# EAGLE design DNS (EAGLE 6.5.0)
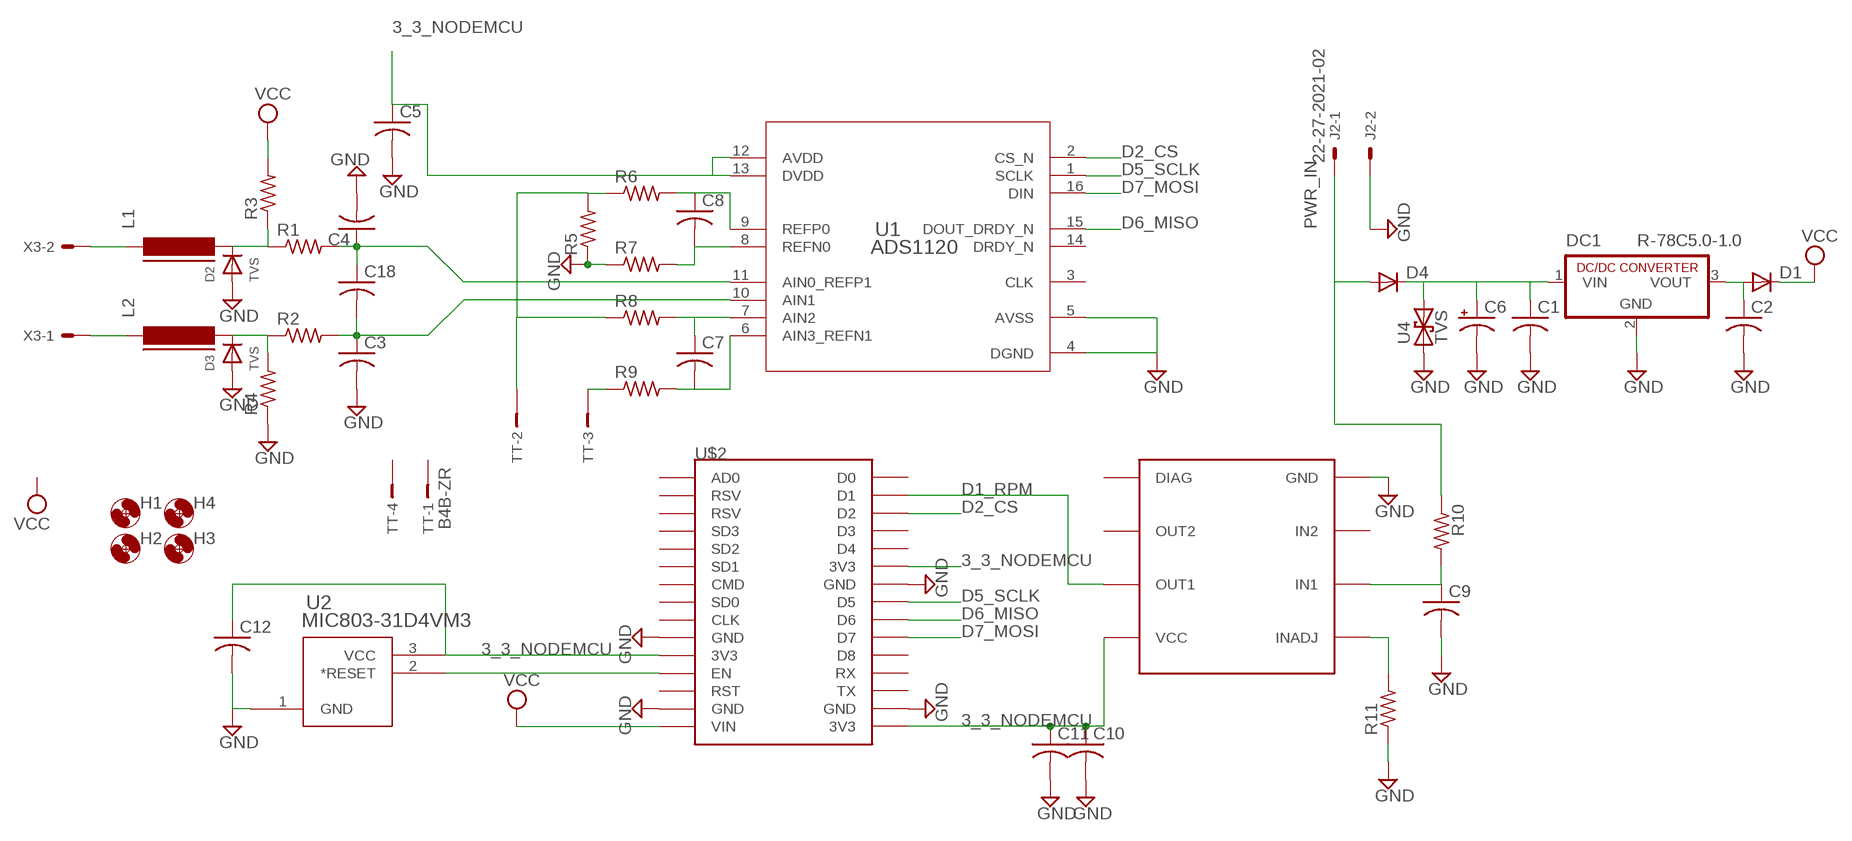
[diagram p0: schematic, sheet 1]

## Parts
C1  C-USC0805  [C0805]
C2  C-USC0805  [C0805]
C3  C-USC0805  [C0805]
C4  C-USC0805  [C0805]
C5  C-USC0805  [C0805]
C6  CPOL-USE5-10.5  [E5-10,5]
C7  C-USC0805  [C0805]
C8  C-USC0805  [C0805]
C9  C-USC0805  [C0805]
C10  C-USC0805  [C0805]
C11  C-USC0805  [C0805]
C12  C-USC0805  [C0805]
C18  C-USC0805  [C0805]
D1  DIODE-DO-214AC  [DO-214AC]
D2  TVS  DIODESOD-323F  [SOD-323F]
D3  TVS  DIODESOD-323F  [SOD-323F]
D4  DIODE-DO-214AC  [DO-214AC]
DC1  R-78C5.0-1.0  [SIP3]
H1  MOUNT-HOLE2.8  [2,8]
H2  MOUNT-HOLE2.8  [2,8]
H3  MOUNT-HOLE2.8  [2,8]
H4  MOUNT-HOLE2.8  [2,8]
J2  22-27-2021-02  [6410-02]
L1  FERRITE-0805  [FB805]
L2  FERRITE-0805  [FB805]
R1  R-US_R0805W  [R0805W]
R2  R-US_R0805W  [R0805W]
R3  R-US_R0805W  [R0805W]
R4  R-US_R0805W  [R0805W]
R5  R-US_R0805W  [R0805W]
R6  R-US_R0805W  [R0805W]
R7  R-US_R0805W  [R0805W]
R8  R-US_R0805W  [R0805W]
R9  R-US_R0805W  [R0805W]
R10  R-US_R0805W  [R0805W]
R11  R-US_R0805W  [R0805W]
TT  B4B-ZR  [B4B-ZR]
U1  ADS1120  ADS1120IPWR  [PW0016A_N]
U2  MIC803-31D4VM3  [SOT-23_M3]
U4  TVS  [SMA-DIODE]
U$1  NCV1124  [TESTER]
U$2  ESP12E_DEVKIT  [ESP12E_DEVKIT]
X3  22-23-2021  [22-23-2021]

## Nets
3_3_NODEMCU: C10.1 C11.1 C12.1 U2.3(VCC) U$1.VCC U$2.3V3@0(3V3) U$2.3V3@1(3V3) U$2.3V3@2(3V3)
D1_RPM: U$1.OUT1 U$2.D1
D2_CS: U1.2(CS_N) U$2.D2
D5_SCLK: U1.1(SCLK) U$2.D5
D6_MISO: U1.15(DOUT_DRDY_N) U$2.D6
D7_MOSI: U1.16(DIN) U$2.D7
GND: C1.2 C2.2 C3.2 C4.2 C5.2 C6.- C9.2 C10.2 C11.2 C12.2 D2.A D3.A DC1.2(GND) J2.2 R4.1 R5.1 R7.1 R11.1 U1.4(DGND) U1.5(AVSS) U2.1(GND) U4.A U$1.GND U$2.GND@0(GND) U$2.GND@1(GND) U$2.GND@2(GND) U$2.GND@3(GND)
N$1: C1.1 C6.+ D4.C DC1.1(VIN) U4.C
N$2: C2.1 D1.A DC1.3(VOUT)
N$3: C7.2 R9.2 U1.6(AIN3_REFN1)
N$4: C8.2 R7.2 U1.8(REFN0)
N$5: D3.C L2.2 R2.1 R4.2
N$6: C4.1 C18.1 R1.2 U1.11(AIN0_REFP1)
N$7: C3.1 C18.2 R2.2 U1.10(AIN1)
N$8: D2.C L1.2 R1.1 R3.1
N$9: R11.2 U$1.INADJ
N$10: C8.1 R6.2 U1.9(REFP0)
N$11: U2.2(*RESET) U$2.EN
N$12: C7.1 R8.2 U1.7(AIN2)
N$13: C9.1 R10.2 U$1.IN1
N$14: L2.1 X3.1
N$15: R9.1 TT.3
N$17: L1.1 X3.2
N$18: C5.1 U1.12(AVDD) U1.13(DVDD)
PWR_IN: D4.A J2.1 R10.1
REF_P: R5.2 R6.1 R8.1 TT.2
VCC: D1.C R3.2 U$2.VIN
Unconnected: TT.1 TT.4 U1.3(CLK) U1.14(DRDY_N) U$1.DIAG U$1.IN2 U$1.OUT2 U$2.AD0 U$2.CLK U$2.CMD U$2.D0 U$2.D3 U$2.D4 U$2.D8 U$2.RST U$2.RSV@0(RSV) U$2.RSV@1(RSV) U$2.RX U$2.SD0 U$2.SD1 U$2.SD2 U$2.SD3 U$2.TX

## Library data of the parts
C1-C5 C7-C12 C18 = adafruit:C-US: CAPACITOR, American symbol
C6 = resistor:CPOL-US: POLARIZED CAPACITOR, American symbol
D1 D4 = diode:DIODE-: DIODE
D2 D3 = adafruit:DIODE: Diode SMADIODE - SMA Surface Mount Package 20V 1A Schottky Diode Digikey: 641-1014-6-ND DO-1N4148 - Through Hole Small Current Diode SOD-123 20V 1 A (.5mV Vf) Schottky Diode - Digikey: MBRX120TPMSCT-ND SOD-323 10V 570mA (.38mV Vf, 3ns) Schottky Diode - Digikey: ZLLS410CT-ND SOD-523 30V 30mA Schottky Diode (RB751S-40TE61) - Digikey: RB751S-40TE61CT-ND SOT23-R/W - SOT23 Package (R = Solder Paste/Reflow Ovens, W = Hand-Soldering) BAT54Film 40V 300mA - Digikey: 497-7162-1-ND
DC1 = dc-dc-converter:R-78C*-1.0: INNOLINE DC/DC-Converter 1.0 AMP SIP3 Single Output Source: Data sheet <http://www.mikrocontroller.net/attachment/150645/157764-da-01-en-DC_DC_WANDLER_R_78C5_0_1_0.pdf>
H1-H4 = holes:MOUNT-HOLE: MOUNTING HOLE with drill center marker
J2 = con-molex:22-?-02: CONNECTOR wire to board 2.54 mm (.1 inch) pitch header; OC_FARNELL: unknown; OC_NEWARK: unknown
L1 L2 = dp_devices:FERRITE: Ferrite bead in various packages
R1-R11 = adafruit:R-US_: RESISTOR, American symbol
TT = con-jst:?4B-ZR: ZH CONNECTOR 1.5 mm, 4 pin 1 row Source: http://www.jst.com .. eZH.pdf; MF: FARNELL; MPN: B4B-ZR(LF)(SN); OC_FARNELL: 1830916; OC_NEWARK: 37K9960
U1 = ADS1120:ADS1120IPWR; ALTERNATEPARTNUMBER: ADS1120IPW; COMPTYPE: IC; MANUFACTURER: Texas Instruments; MOUNTTYPE: SMT; PACKAGEREFERENCE: PW0016A; PARTNUMBER: ADS1120IPWR; PIN_COUNT: 16; REFDES: RefDes; ROHS: Y; TYPE: TYPE; VALUE: Value
U2 = MIC803:MIC803-31D4VM3; COPYRIGHT: Copyright (C) 2015 Accelerated Designs. All rights reserved; MANUFACTURER_PART_NUMBER: mic803-31d4vm3; VENDOR: MICREL
U4 = SparkFun-DiscreteSemi:TVS: Transient voltage suppressor- prevents ESD on inputs. Ignore package description- MBRA140 is NOT this type of part!!!
U$1 = NCV1124:NCV1124
U$2 = ESP12E_DEVKIT:ESP12E_DEVKIT: ESP12E DEVKIT BOARD
X3 = con-molex:22-23-2021: .100" (2.54mm) Center Header - 2 Pin; MF: MOLEX; MPN: 22-23-2021; OC_FARNELL: 1462926; OC_NEWARK: 25C3832

## Board
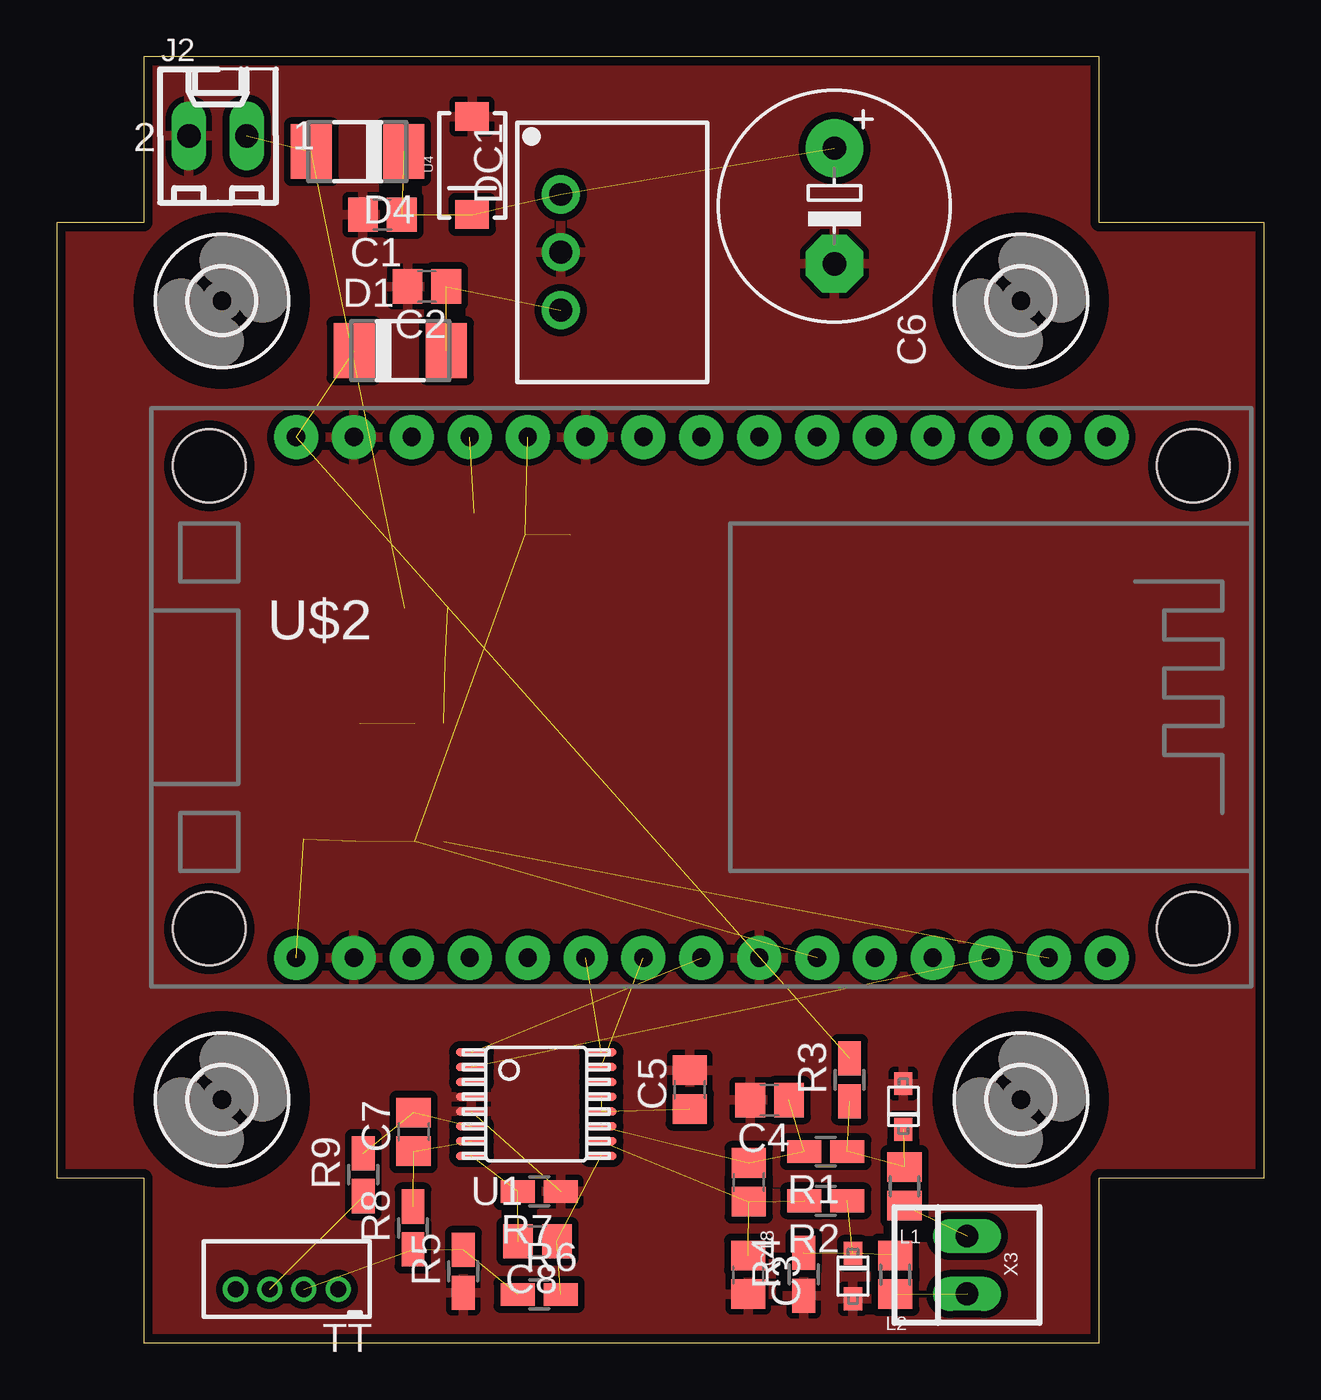
[diagram p1: board, top side]
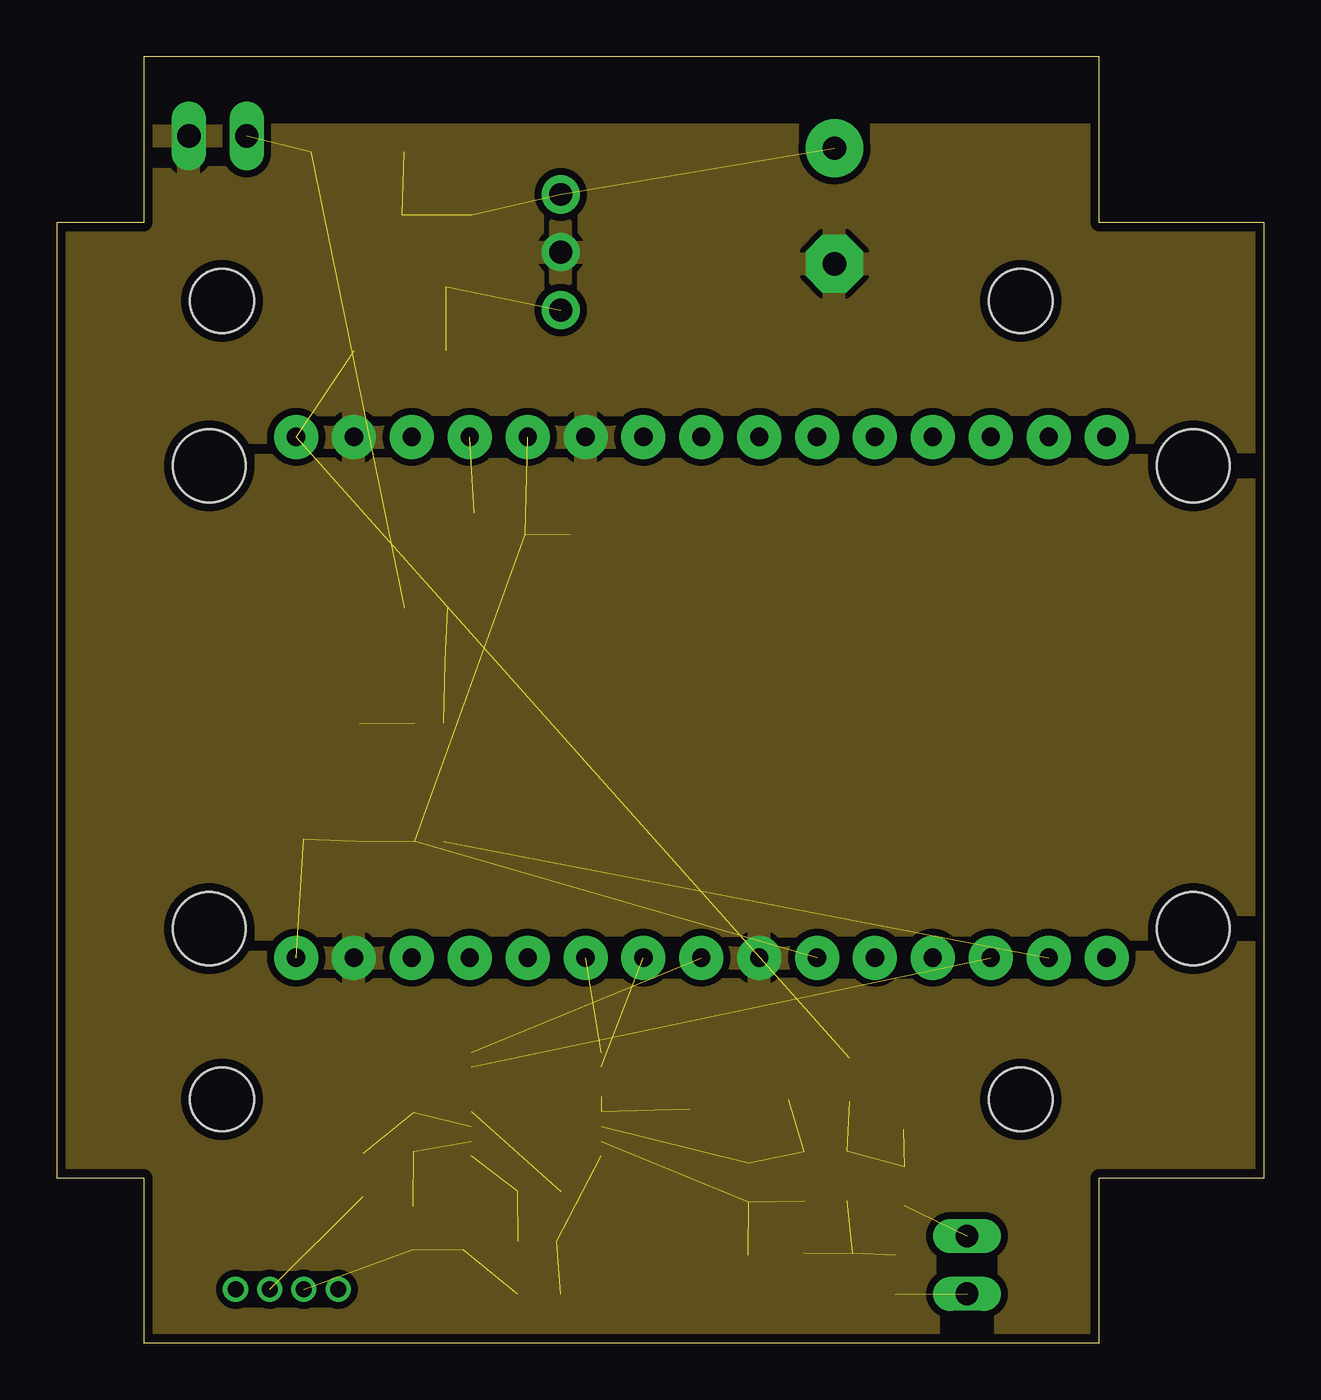
[diagram p2: board, inner layer Route2]
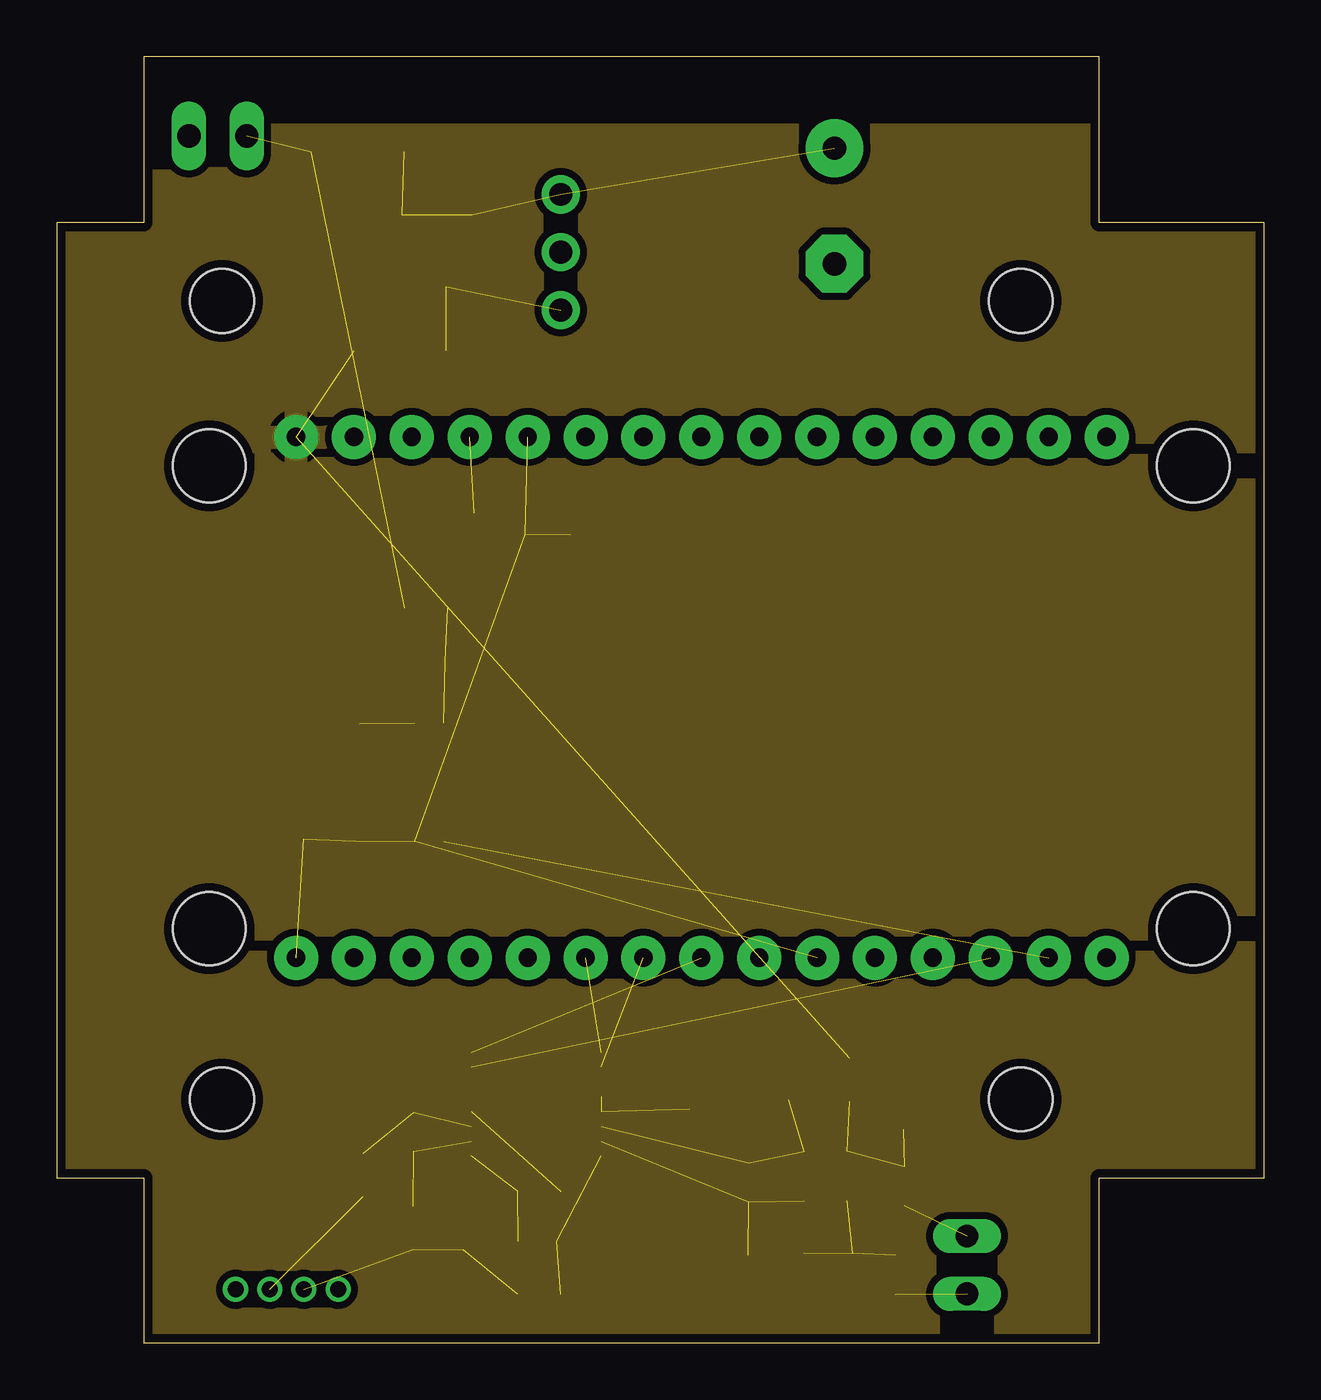
[diagram p3: board, inner layer Route15]
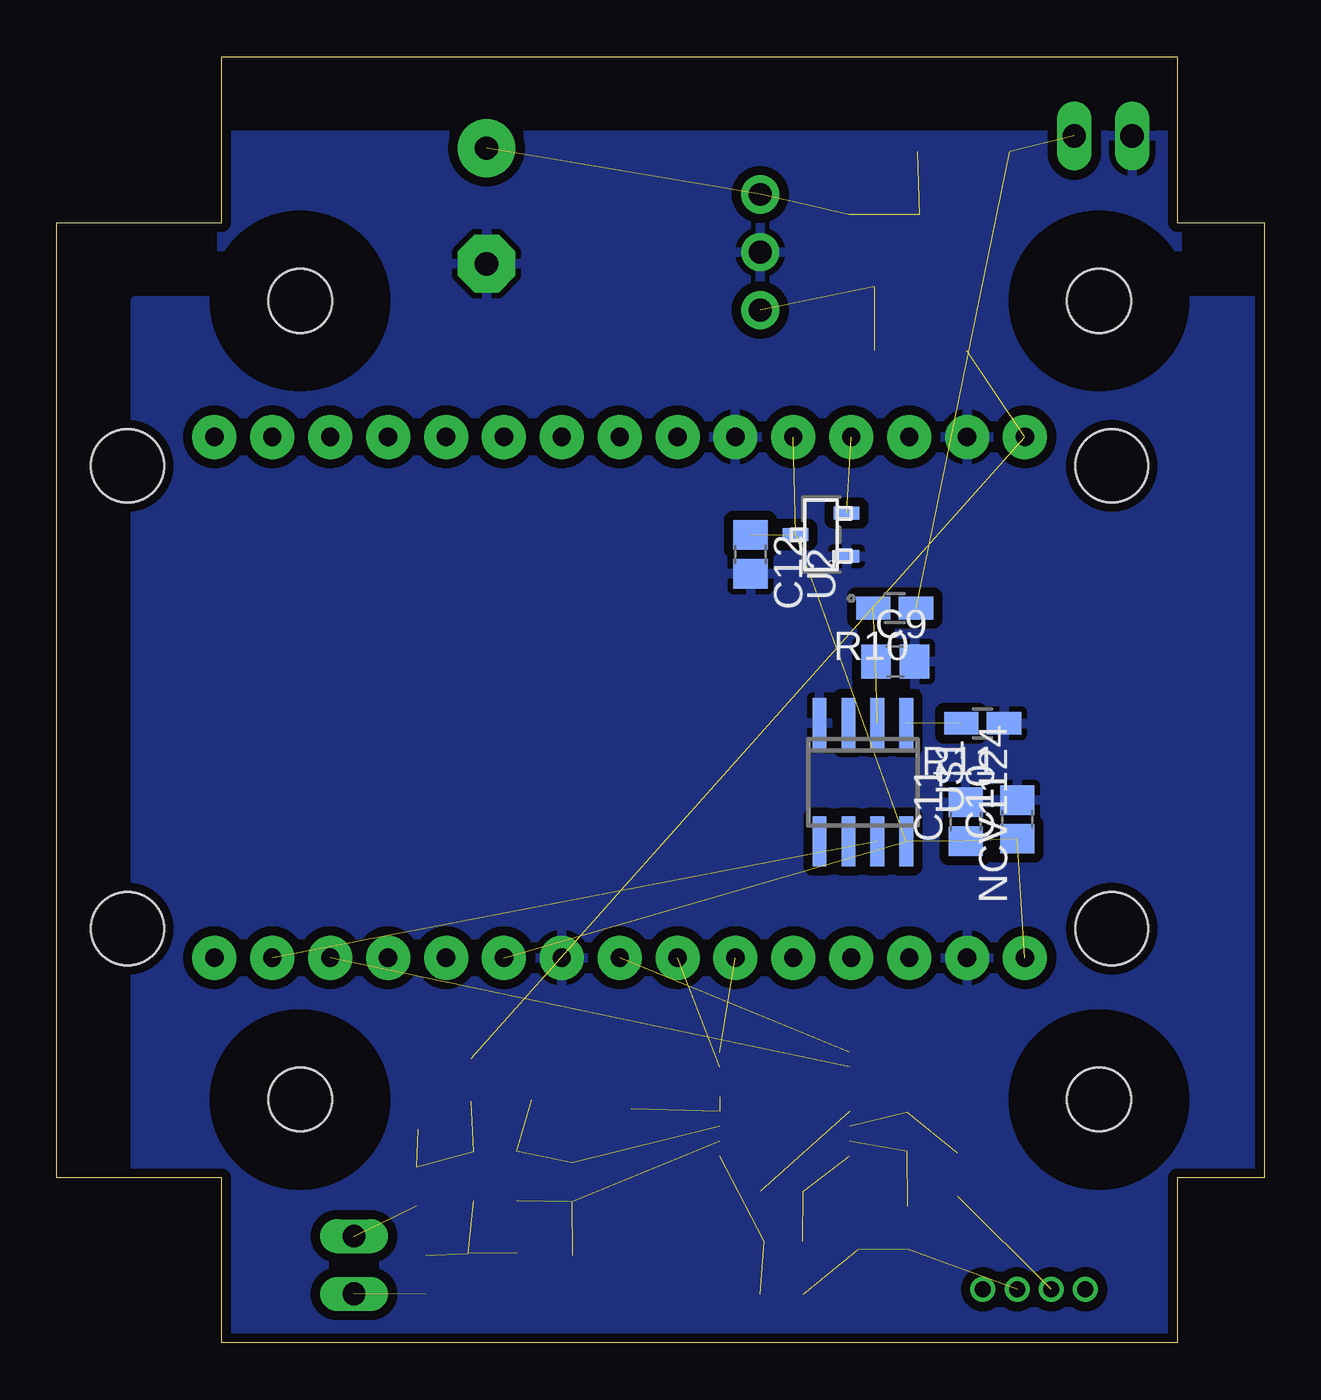
[diagram p4: board, bottom side, seen from below]

Size 52.96 x 56.43 mm. Coordinates in mm from the lower left corner, seen from the top.
Outline: 0,7.24 3.81,7.24 3.81,0 45.72,0 45.72,7.24 52.96,7.24 52.96,49.15 45.72,49.15 45.72,56.43 3.81,56.43 3.81,49.15 0,49.15 0,7.24
Copper layers (1*16): Top 0.0356mm / dielectric 1.5011mm / Bottom 0.0356mm
Design rules "default": minimum track width 6mil, minimum drill 13mil, track to track 6mil, track to pad 6mil, pad to pad 6mil, via to via 6mil, smd to smd 6mil, copper to edge 15mil, drill to drill 6mil, minimum pad ring 7mil, minimum via ring 7mil, stop-mask expansion 4mil, vias tented up to drill 0mil, thermal gap 10mil

### Footprints (pad centres in the part's own frame; a part is rotated, then mirrored left to right if it is on the bottom)
C0805 = smd 1.3 x 1.5: 1 -0.85,0; 2 0.85,0
E5-10,5 = drill 1.016 pad 2.54: + -2.54,0 | drill 1.016 pad 2.54 octagon: - 2.54,0
DO-214AC = smd 1.8 x 2.4: A 2.025,0; C -2.025,0
SOD-323F = smd 1 x 0.8: A -1,0; C 1,0
SIP3 = drill 1 pad 1.676: 1 -2.54,0; 2 0,0; 3 2.54,0
2,8 = hole 2.8: 0,0
6410-02 = drill 1.016 long: 1 1.27,0; 2 -1.27,0
FB805 = smd 1.3 x 1.5: 1 -0.85,0; 2 0.85,0
R0805W = smd 1.5 x 1: 1 -0.94,0; 2 0.94,0
B4B-ZR = drill 0.7 pad 1.1: 1 -2.25,0; 2 -0.75,0; 3 0.75,0; 4 2.25,0
PW0016A_N = smd 1.35 x 0.35: 1 -2.85,2.275; 2 -2.85,1.625; 3 -2.85,0.975; 4 -2.85,0.325; 5 -2.85,-0.325; 6 -2.85,-0.975; 7 -2.85,-1.625; 8 -2.85,-2.275; 9 2.85,-2.275; 10 2.85,-1.625; 11 2.85,-0.975; 12 2.85,-0.325; 13 2.85,0.325; 14 2.85,0.975; 15 2.85,1.625; 16 2.85,2.275
SOT-23_M3 = smd 0.559 x 1.118: 1 -0.95,-1.118; 2 0.95,-1.118; 3 0,1.118
SMA-DIODE = smd 1.27 x 1.47: A -2.15,0; C 2.15,0
TESTER = smd 0.6 x 2.2: DIAG 1.905,2.6; GND 1.905,-2.6; IN1 -0.635,-2.6; IN2 0.635,-2.6; INADJ -1.905,-2.6; OUT1 -0.635,2.6; OUT2 0.635,2.6; VCC -1.905,2.6
ESP12E_DEVKIT = drill 0.8 pad 1.93: 3V3@0 -11.43,-7.62; 3V3@1 11.43,5.08; 3V3@2 11.43,-17.78; AD0 -11.43,17.78; CLK -11.43,-2.54; CMD -11.43,2.54; D0 11.43,17.78; D1 11.43,15.24; D2 11.43,12.7; D3 11.43,10.16; D4 11.43,7.62; D5 11.43,0; D6 11.43,-2.54; D7 11.43,-5.08; D8 11.43,-7.62; EN -11.43,-10.16; GND@0 -11.43,-5.08; GND@1 -11.43,-15.24; GND@2 11.43,2.54; GND@3 11.43,-15.24; RST -11.43,-12.7; RSV@0 -11.43,15.24; RSV@1 -11.43,12.7; RX 11.43,-10.16; SD0 -11.43,0; SD1 -11.43,5.08; SD2 -11.43,7.62; SD3 -11.43,10.16; TX 11.43,-12.7; VIN -11.43,-17.78 | hole 3.2: -10.16,21.59; 10.16,21.59; 10.16,-21.59; -10.16,-21.59
22-23-2021 = drill 1 long: 1 -1.27,0; 2 1.27,0

### Placement (x,y rotation side)
C1  14.27,49.5 180 top
C2  16.23,46.35 180 top
C3  30.33,2.97 270 top
C4  31.27,10.64 180 top
C5  27.76,11.1 90 top
C6  34.11,49.89 270 top
C7  15.65,9.25 90 top
C8  21.08,4.45 180 top
C9  16.18,29.9 0 bottom
C10  10.82,22.96 90 bottom
C11  13.08,22.86 90 bottom
C12  22.53,34.59 270 bottom
C18  30.35,7.04 270 top
D1  15.06,43.54 0 top
D2  37.13,10.36 270 top
D3  34.92,2.92 90 top
D4  13.18,52.27 180 top
DC1  22.1,47.85 270 top
H1  7.24,45.72 0 top
H2  7.24,10.67 0 top
H3  42.29,45.72 0 top
H4  42.29,10.67 0 top
J2  7.06,52.96 0 top
L1  37.19,6.86 90 top
L2  36.78,2.97 90 top
R1  33.73,8.38 180 top
R2  33.73,6.22 180 top
R3  34.77,11.53 90 top
R4  32.77,3 90 top
R5  17.83,3.12 90 top
R6  21.16,2.11 0 top
R7  21.16,6.63 180 top
R8  15.62,5.03 90 top
R9  13.44,7.37 90 top
R10  16.21,32.23 180 bottom
R11  12.34,27.18 180 bottom
TT  10.08,2.34 180 top
U1  21.03,10.46 0 top
U2  19.43,35.46 90 bottom
U4  18.21,51.66 270 top
U$1  17.6,24.59 180 bottom
U$2  28.27,28.32 270 top
X3  39.93,3.4 90 top

### Tracks (layer width: path | path; a pad name or v marks a point on that pad's centre or on a via)
3_3_NODEMCU  (7 unrouted)
D1_RPM  (1 unrouted)
D2_CS  (1 unrouted)
D5_SCLK  (1 unrouted)
D6_MISO  (1 unrouted)
D7_MOSI  (1 unrouted)
GND  (1 unrouted)
  pour Route2 (isolate 0.305): 0.51,0.51 53,0.51 53,53 0.51,53
  pour Top (isolate 0.305, rank 2): 0,7.21 3.81,7.09 3.81,0 45.72,0 45.64,7.06 53.01,7.29 53.01,49.05 45.87,49 45.67,56.5 3.89,56.48 3.94,49.07 0,49.2
  pour Bottom (isolate 0.406): 0,3.81 3.81,3.81 3.81,0 45.72,0 45.72,3.81 49.53,3.81 49.53,45.72 45.72,45.72 45.72,53 3.81,53 3.81,45.72 0,45.72
N$1  (4 unrouted)
N$2  (2 unrouted)
N$3  (2 unrouted)
N$4  (2 unrouted)
N$5  (3 unrouted)
N$6  (3 unrouted)
N$7  (3 unrouted)
N$8  (3 unrouted)
N$9  (1 unrouted)
N$10  (2 unrouted)
N$11  (1 unrouted)
N$12  (2 unrouted)
N$13  (2 unrouted)
N$14  (1 unrouted)
N$15  (1 unrouted)
N$16
  pour Top (no thermals): 30.96,3.99 31.34,1.96 31.34,3.61
N$17  (1 unrouted)
N$18  (2 unrouted)
PWR_IN  (2 unrouted)
REF_P  (3 unrouted)
VCC  (2 unrouted)
  pour Route15 (isolate 0.305): 0.51,0.51 53,0.51 53,53 0.51,53